# Altium schematic sheet loom-pedal-box.SchDoc
size 594 x 420 mm
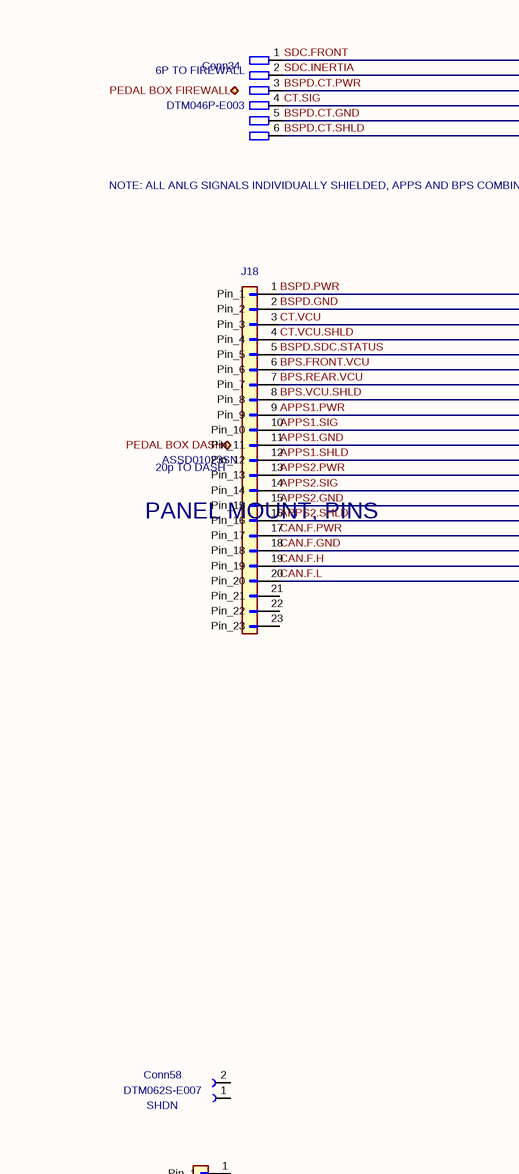
[diagram p0: loom-pedal-box.SchDoc, top left]
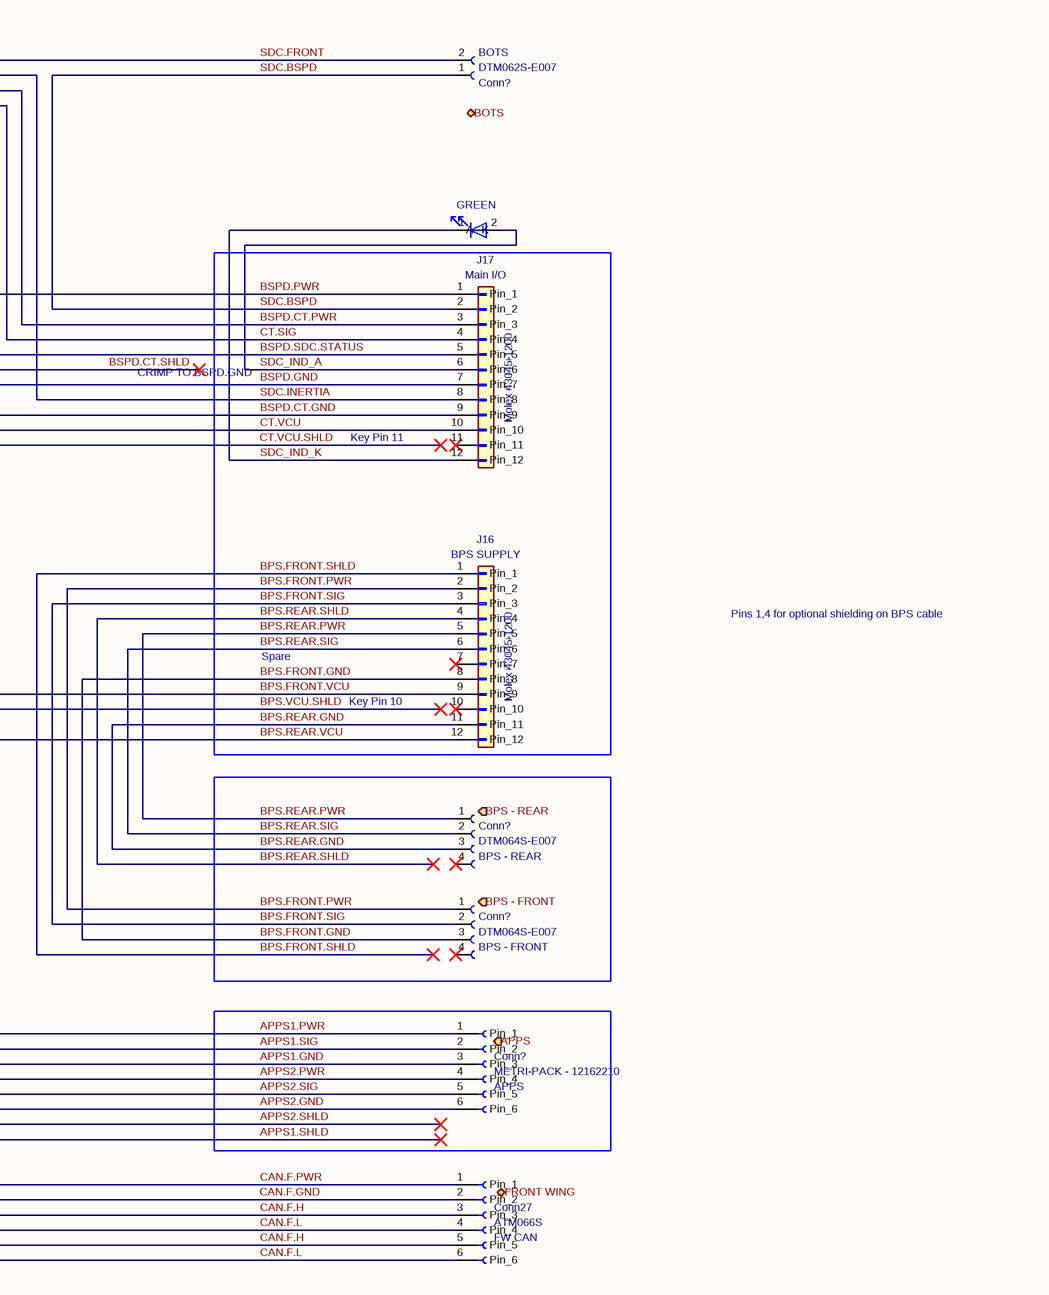
[diagram p1: loom-pedal-box.SchDoc, top right]
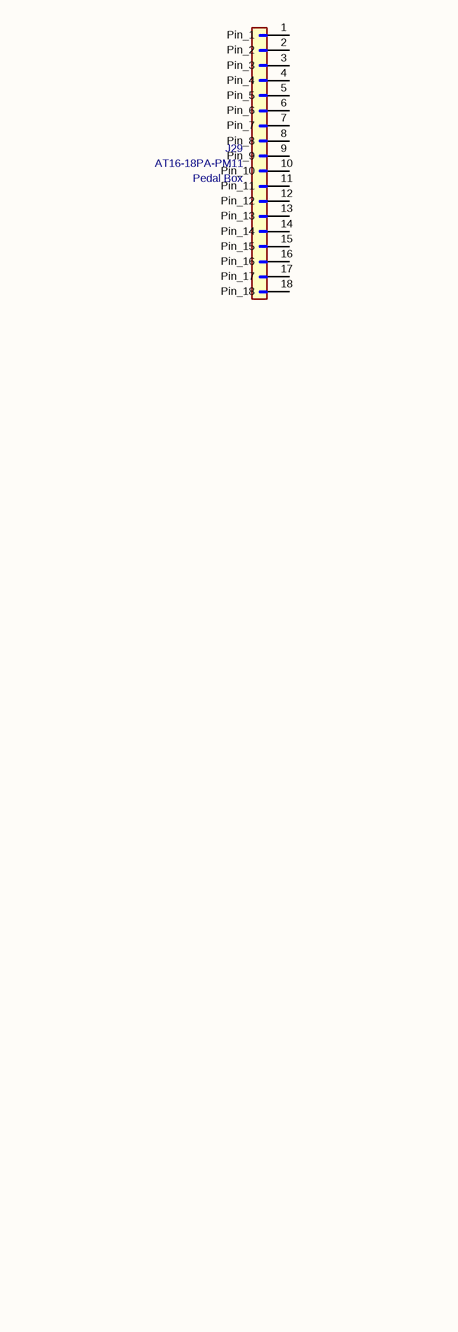
[diagram p2: loom-pedal-box.SchDoc, bottom left]
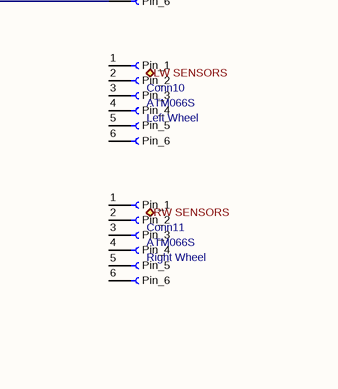
[diagram p3: loom-pedal-box.SchDoc, bottom right]

## Parts
(Parts that share a designator on the sheet are numbered #1, #2 ... from top to bottom, then left to right.)
Conn10  Conn Name: Left Wheel  (hidden comment: ATM066S)
Conn11  Conn Name: Right Wheel  (hidden comment: ATM066S)
Conn27  Conn Name: FW CAN  (hidden comment: ATM066S)
Conn34  P/N: DTM046P-E003  (hidden comment: Deutsch_DTM_6P_Pin)
Conn58  P/N: DTM062S-E007  Conn Name: SHDN  (hidden comment: Deutsch_DTM_2S_Pin)
Conn?#1  P/N: DTM062S-E007  Conn Name: BOTS  (hidden comment: Deutsch_DTM_2S_Pin)
Conn?#2  P/N: DTM064S-E007  Conn Name: BPS - REAR  (hidden comment: Deutsch_DTM_4S_Pin)
Conn?#3  P/N: DTM064S-E007  Conn Name: BPS - FRONT  (hidden comment: Deutsch_DTM_4S_Pin)
Conn?#4  Conn Name: APPS  (hidden comment: METRI-PACK - 12162210)
D6  GREEN
J16  P/N: Molex 43045-1200  [Molex_Micro-Fit_3.0_43045-1200_2x06_P3.00mm_Horizontal]  (hidden comment: BPS SUPPLY)
J17  P/N: Molex 43045-1200  [Molex_Micro-Fit_3.0_43045-1200_2x06_P3.00mm_Horizontal]  (hidden comment: Main I/O)
J18  ASSD01023SN
J29  Conn Name: Pedal Box  (hidden comment: AT16-18PA-PM11)

## Ports
APPS (in), BOTS (bidir), BPS - FRONT (in), BPS - REAR (in), FRONT WING (bidir), LW SENSORS (bidir), PEDAL BOX DASH (bidir), PEDAL BOX FIREWALL (bidir), RW SENSORS (bidir)

## Nets
APPS1.GND: Conn?#4.3(Pin_3) J18.11(Pin_11)
APPS1.PWR: Conn?#4.1(Pin_1) J18.9(Pin_9)
APPS1.SHLD: J18.12(Pin_12)
APPS1.SIG: Conn?#4.2(Pin_2) J18.10(Pin_10)
APPS2.GND: Conn?#4.6(Pin_6) J18.15(Pin_15)
APPS2.PWR: Conn?#4.4(Pin_4) J18.13(Pin_13)
APPS2.SHLD: J18.16(Pin_16)
APPS2.SIG: Conn?#4.5(Pin_5) J18.14(Pin_14)
BPS.FRONT.GND: Conn?#3.3 J16.8(Pin_8)
BPS.FRONT.PWR: Conn?#3.1 J16.2(Pin_2)
BPS.FRONT.SHLD: J16.1(Pin_1)
BPS.FRONT.SIG: Conn?#3.2 J16.3(Pin_3)
BPS.FRONT.VCU: J16.9(Pin_9) J18.6(Pin_6)
BPS.REAR.GND: Conn?#2.3 J16.11(Pin_11)
BPS.REAR.PWR: Conn?#2.1 J16.5(Pin_5)
BPS.REAR.SHLD: J16.4(Pin_4)
BPS.REAR.SIG: Conn?#2.2 J16.6(Pin_6)
BPS.REAR.VCU: J16.12(Pin_12) J18.7(Pin_7)
BPS.VCU.SHLD: J18.8(Pin_8)
BSPD.CT.GND: Conn34.5 J17.9(Pin_9)
BSPD.CT.PWR: Conn34.3 J17.3(Pin_3)
BSPD.CT.SHLD: Conn34.6
BSPD.GND: J17.7(Pin_7) J18.2(Pin_2)
BSPD.PWR: J17.1(Pin_1) J18.1(Pin_1)
BSPD.SDC.STATUS: J17.5(Pin_5) J18.5(Pin_5)
CAN.F.GND: Conn27.2(Pin_2) J18.18(Pin_18)
CAN.F.H: Conn27.3(Pin_3) Conn27.5(Pin_5) J18.19(Pin_19)
CAN.F.L: Conn27.4(Pin_4) Conn27.6(Pin_6) J18.20(Pin_20)
CAN.F.PWR: Conn27.1(Pin_1) J18.17(Pin_17)
CT.SIG: Conn34.4 J17.4(Pin_4)
CT.VCU: J17.10(Pin_10) J18.3(Pin_3)
CT.VCU.SHLD: J18.4(Pin_4)
SDC.BSPD: Conn?#1.1 J17.2(Pin_2)
SDC.FRONT: Conn34.1 Conn?#1.2
SDC.INERTIA: Conn34.2 J17.8(Pin_8)
SDC_IND_A: D6.2(A) J17.6(Pin_6)
SDC_IND_K: D6.1(K) J17.12(Pin_12)

Not connected (* = marked no-connect by the designer): Conn10 1(Pin_1) 2(Pin_2) 3(Pin_3) 4(Pin_4) 5(Pin_5) 6(Pin_6); Conn11 1(Pin_1) 2(Pin_2) 3(Pin_3) 4(Pin_4) 5(Pin_5) 6(Pin_6); Conn58 1 2; Conn?#2 4*; Conn?#3 4*; J16 7(Pin_7)* 10(Pin_10)*; J17 11(Pin_11)*; J18 21(Pin_21) 22(Pin_22) 23(Pin_23); J29 1(Pin_1) 2(Pin_2) 3(Pin_3) 4(Pin_4) 5(Pin_5) 6(Pin_6) 7(Pin_7) 8(Pin_8) 9(Pin_9) 10(Pin_10) 11(Pin_11) 12(Pin_12) 13(Pin_13) 14(Pin_14) 15(Pin_15) 16(Pin_16) 17(Pin_17) 18(Pin_18)

## Notes on the sheet
- (near Conn34) 6P TO FIREWALL
- (near Conn34) NOTE: ALL ANLG SIGNALS
  INDIVIDUALLY SHIELDED,
  APPS AND BPS COMBINED
  AT CONNECTOR WITH FLY
  WIRE TO MINI PDM.
  CT.SIG HAS DEDICATED
  SHIELD TO MINI PDM
- CRIMP TO BSPD.GND
- (near J18) 20p TO DASH
- Key Pin 11
- (near J18) PANEL MOUNT,
  PINS
- Pins 1,4 for
  optional shielding
  on BPS cable
- Spare
- Key Pin 10
- 1
- 2
- 3
- 4
- 5
- 6
- 7
- 8
- 9
- 10
- 11
- A
- B
- C
- D
- E
- F
- G
- H
- Title: LOOM - PEDAL BOX
- File: loom-pedal-box.kicad_sch
- Sheet: /
- KiCad E.D.A.  kicad (5.1.4)-1
- Size: A2
- Date:
- Rev:
- Id: 1/1

## Library data of the parts
Conn10 Conn11 Conn27 Conn?#4 = Conn_01x06_Socket
  Conn10 Conn11 Conn27: Value: ATM066S
  Conn?#4: Value: METRI-PACK - 12162210
D6 = LED: Description: Light emitting diode; Sim.Pins: 1=K 2=A; Value: GREEN
J16 J17 = Conn_01x12: Description: Generic connector, single row, 01x12, script generated (kicad-library-utils/schlib/autogen/connector/); To Order: INV; Footprint: Connector_Molex:Molex_Micro-Fit_3.0_43045-1200_2x06_P3.00mm_Horizontal
  J16: Value: BPS SUPPLY
  J17: Value: Main I/O
J18 = Conn_01x23: Description: Generic connector, single row, 01x23, script generated (kicad-library-utils/schlib/autogen/connector/); Value: ASSD01023SN
J29 = Conn_01x18: Description: Generic connector, single row, 01x18, script generated (kicad-library-utils/schlib/autogen/connector/); Value: AT16-18PA-PM11
Conn34 = Deutsch_DTM_6P_Pin: Value: Deutsch_DTM_6P_Pin
Conn58 Conn?#1 = Deutsch_DTM_2S_Pin: Value: Deutsch_DTM_2S_Pin
Conn?#2 Conn?#3 = Deutsch_DTM_4S_Pin: Value: Deutsch_DTM_4S_Pin